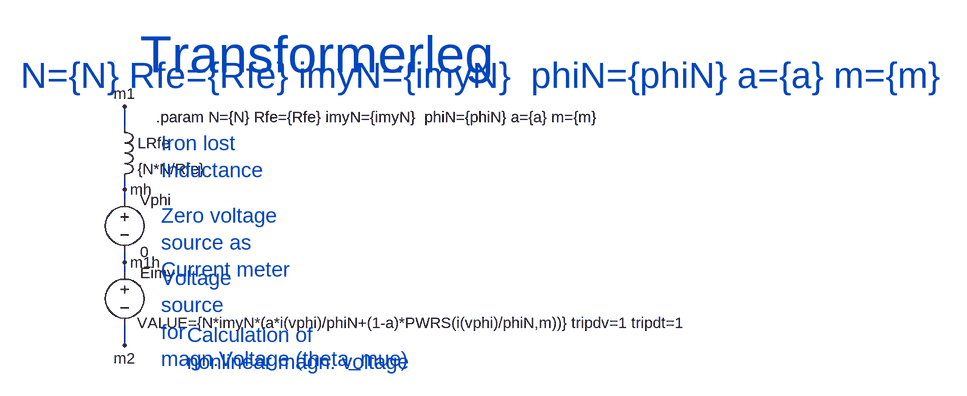
[diagram p0: schematic schenkel_designed.asc]
schenkel_designed.asc, the LTspice schematic file:
Version 4.1
SHEET 1 880 680
WIRE 192 96 192 64
WIRE 192 192 192 176
WIRE 192 208 192 192
WIRE 192 304 192 288
WIRE 192 320 192 304
WIRE 192 432 192 400
FLAG 192 64 m1
FLAG 192 432 m2
FLAG 192 304 m1h
FLAG 192 192 mh
SYMBOL ind 176 80 R0
SYMATTR InstName LRfe
SYMATTR Value {N*N/Rfe}
SYMATTR SpiceLine Rser=0
SYMBOL voltage 192 192 R0
SYMATTR InstName Vphi
SYMATTR Value 0
SYMBOL voltage 192 304 R0
WINDOW 3 19 93 Left 2
SYMATTR InstName Eimy
SYMATTR Value VALUE={N*imyN*(a*i(vphi)/phiN+(1-a)*PWRS(i(vphi)/phiN,m))} tripdv=1 tripdt=1
TEXT 32 16 Left 5 ;N={N} Rfe={Rfe} imyN={imyN}  phiN={phiN} a={a} m={m}
TEXT 240 80 Left 2 !.param N={N} Rfe={Rfe} imyN={imyN}  phiN={phiN} a={a} m={m}
TEXT 248 120 Left 3 ;Iron lost \nInductance
TEXT 248 232 Left 3 ;Zero voltage\nsource as\nCurrent meter
TEXT 248 328 Left 3 ;Voltage \nsource\nfor \nmagn.Voltage (theta_mue)
TEXT 288 416 Left 3 ;Calculation of \nnonlinear magn. voltage
TEXT 216 -16 Left 6 ;Transformerleg

The netlist it stands for:
* schenkel_designed.asc
LRfe m1 mh {N*N/Rfe} Rser=0
Vphi mh m1h 0
V§Eimy m1h m2 VALUE={N*imyN*(a*i(vphi)/phiN+(1-a)*PWRS(i(vphi)/phiN,m))} tripdv=1 tripdt=1
* N={N} Rfe={Rfe} imyN={imyN}  phiN={phiN} a={a} m={m}
.param N={N} Rfe={Rfe} imyN={imyN}  phiN={phiN} a={a} m={m}
* Iron lost
* Inductance
* Zero voltage
* source as
* Current meter
* Voltage
* source
* for
* magn.Voltage (theta_mue)
* Calculation of
* nonlinear magn. voltage
* Transformerleg
.backanno
.end